# EAGLE design r2r-dac (EAGLE 7.6.0)
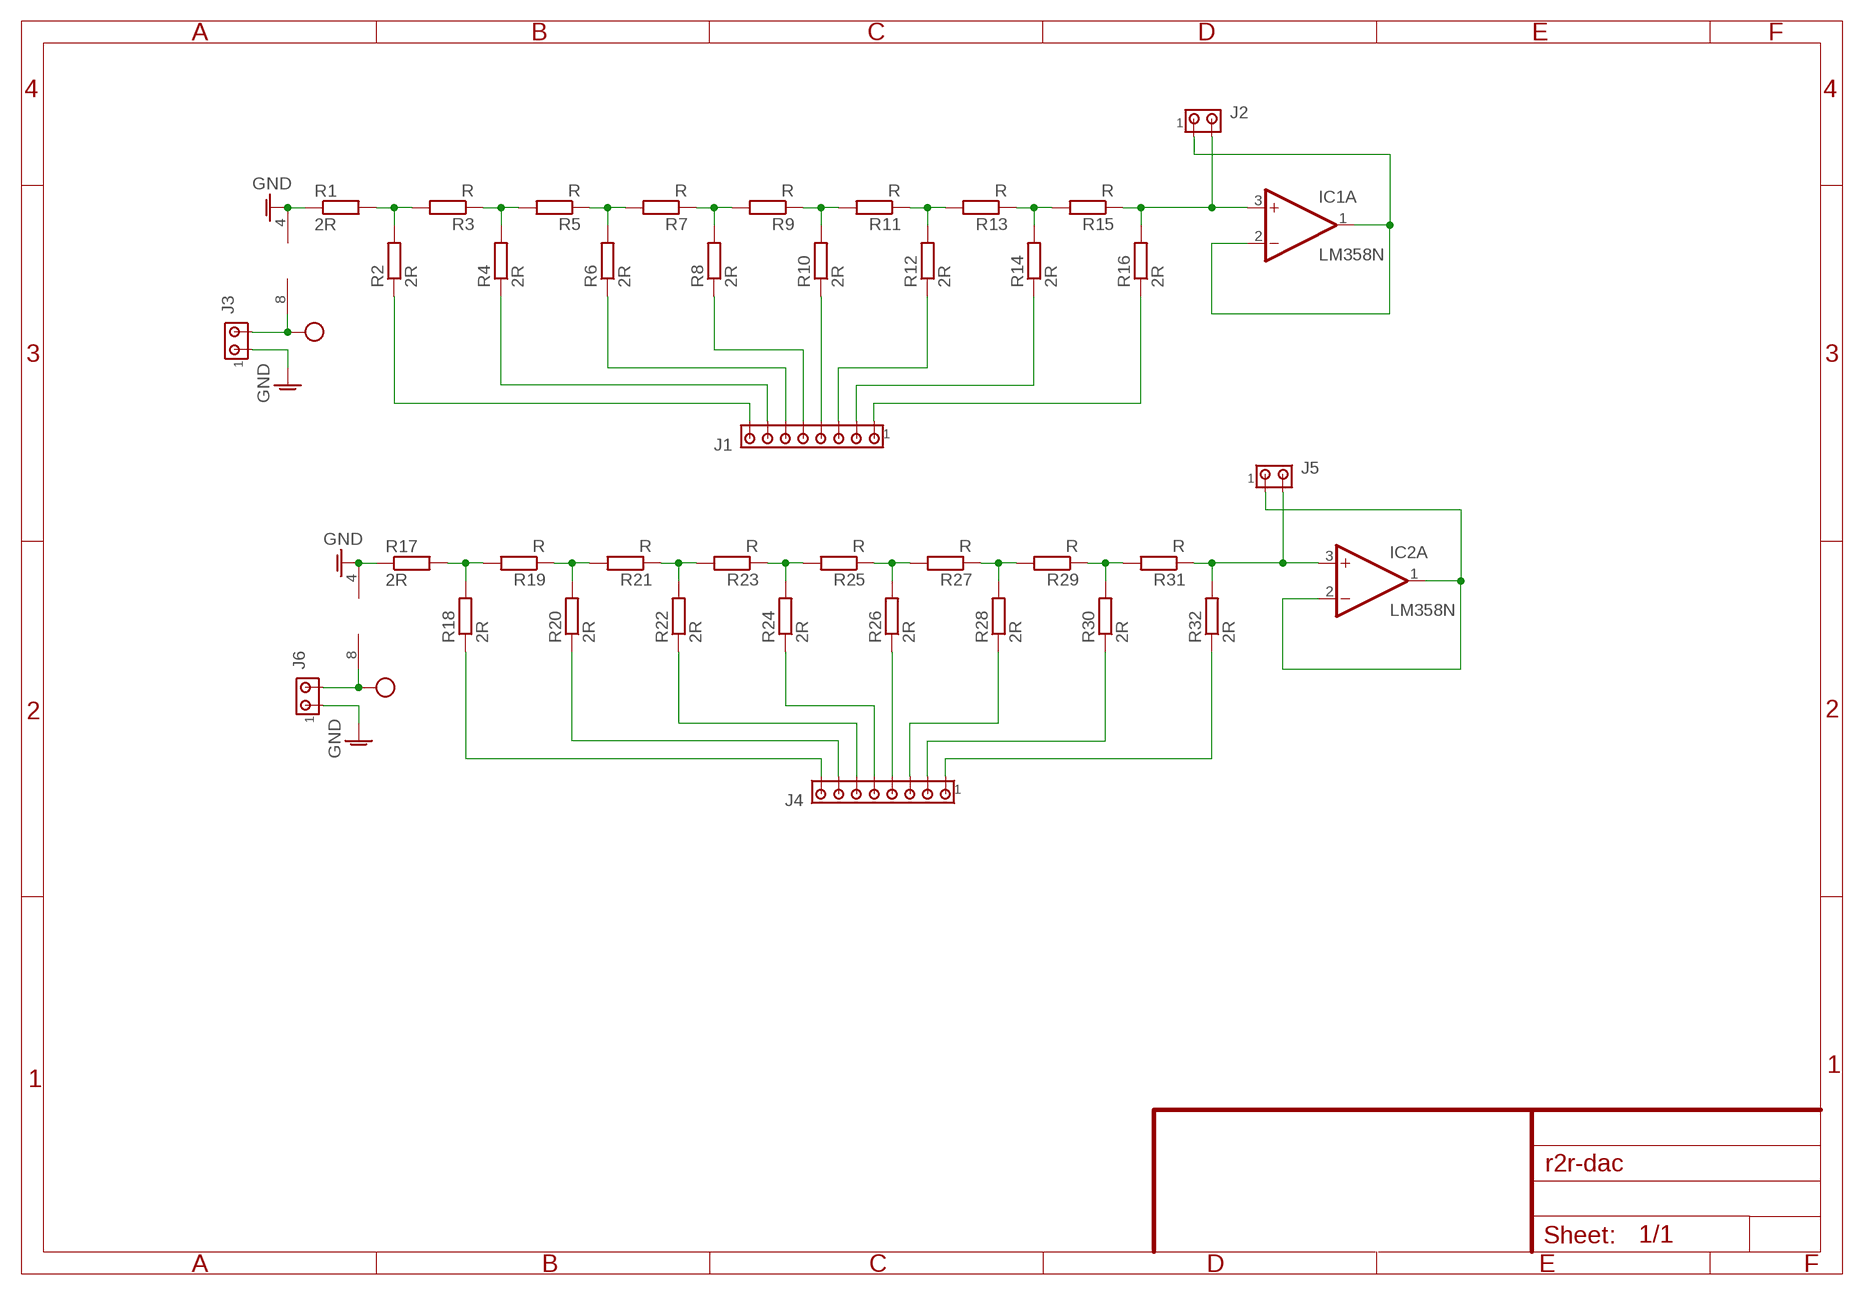
[diagram p0: schematic, sheet 1]

## Parts
IC1  LM358N  [DIL08]
IC2  LM358N  [DIL08]
J1  MTA08-100  [10X08MTA]
J2  MTA02-100  [10X02MTA]
J3  MTA02-100  [10X02MTA]
J4  MTA08-100  [10X08MTA]
J5  MTA02-100  [10X02MTA]
J6  MTA02-100  [10X02MTA]
R1  2R  R-EU_0207/10  [0207/10]
R2  2R  R-EU_0207/10  [0207/10]
R3  R  R-EU_0207/10  [0207/10]
R4  2R  R-EU_0207/10  [0207/10]
R5  R  R-EU_0207/10  [0207/10]
R6  2R  R-EU_0207/10  [0207/10]
R7  R  R-EU_0207/10  [0207/10]
R8  2R  R-EU_0207/10  [0207/10]
R9  R  R-EU_0207/10  [0207/10]
R10  2R  R-EU_0207/10  [0207/10]
R11  R  R-EU_0207/10  [0207/10]
R12  2R  R-EU_0207/10  [0207/10]
R13  R  R-EU_0207/10  [0207/10]
R14  2R  R-EU_0207/10  [0207/10]
R15  R  R-EU_0207/10  [0207/10]
R16  2R  R-EU_0207/10  [0207/10]
R17  2R  R-EU_0207/10  [0207/10]
R18  2R  R-EU_0207/10  [0207/10]
R19  R  R-EU_0207/10  [0207/10]
R20  2R  R-EU_0207/10  [0207/10]
R21  R  R-EU_0207/10  [0207/10]
R22  2R  R-EU_0207/10  [0207/10]
R23  R  R-EU_0207/10  [0207/10]
R24  2R  R-EU_0207/10  [0207/10]
R25  R  R-EU_0207/10  [0207/10]
R26  2R  R-EU_0207/10  [0207/10]
R27  R  R-EU_0207/10  [0207/10]
R28  2R  R-EU_0207/10  [0207/10]
R29  R  R-EU_0207/10  [0207/10]
R30  2R  R-EU_0207/10  [0207/10]
R31  R  R-EU_0207/10  [0207/10]
R32  2R  R-EU_0207/10  [0207/10]

## Nets
GND: IC1.4(P:V-) IC2.4(P:V-) J3.1 J6.1 R1.1 R17.1
N$1: R1.2 R2.2 R3.2
N$2: R3.1 R4.2 R5.2
N$3: R5.1 R6.2 R7.2
N$4: R7.1 R8.2 R9.2
N$5: R9.1 R10.2 R11.2
N$6: R11.1 R12.2 R13.2
N$7: R13.1 R14.2 R15.2
N$8: IC1.3(A:+IN) J2.2 R15.1 R16.2
N$9: J1.8 R2.1
N$10: J1.7 R4.1
N$11: J1.6 R6.1
N$12: J1.5 R8.1
N$13: J1.4 R10.1
N$14: J1.3 R12.1
N$15: J1.2 R14.1
N$16: J1.1 R16.1
N$17: R17.2 R18.2 R19.2
N$19: IC1.1(A:OUT) IC1.2(A:-IN) J2.1
N$20: R19.1 R20.2 R21.2
N$21: R21.1 R22.2 R23.2
N$22: R23.1 R24.2 R25.2
N$23: R25.1 R26.2 R27.2
N$24: R27.1 R28.2 R29.2
N$25: R29.1 R30.2 R31.2
N$26: IC2.3(A:+IN) J5.2 R31.1 R32.2
N$27: J4.8 R18.1
N$28: J4.7 R20.1
N$29: J4.6 R22.1
N$30: J4.5 R24.1
N$31: J4.4 R26.1
N$32: J4.3 R28.1
N$33: J4.2 R30.1
N$34: J4.1 R32.1
N$35: IC2.1(A:OUT) IC2.2(A:-IN) J5.1
VDD: IC1.8(P:V+) IC2.8(P:V+) J3.2 J6.2
Unconnected: IC1.5(B:+IN) IC1.6(B:-IN) IC1.7(B:OUT) IC2.5(B:+IN) IC2.6(B:-IN) IC2.7(B:OUT)

## Library data of the parts
IC1 IC2 = linear:LM358N: OP AMP
J1 J4 = con-amp:MTA08-100: AMP CONNECTOR
J2 J3 J5 J6 = con-amp:MTA02-100: AMP CONNECTOR
R1-R32 = rcl:R-EU_: RESISTOR, European symbol

## Board
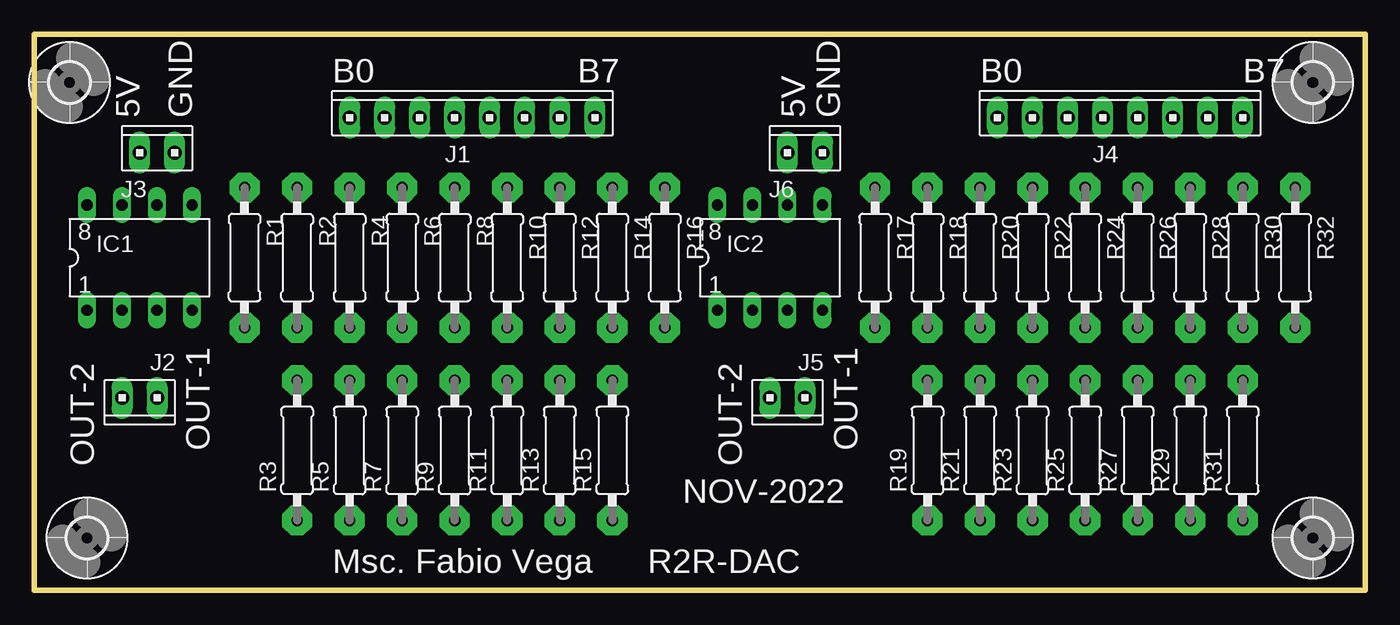
[diagram p1: board, top side]
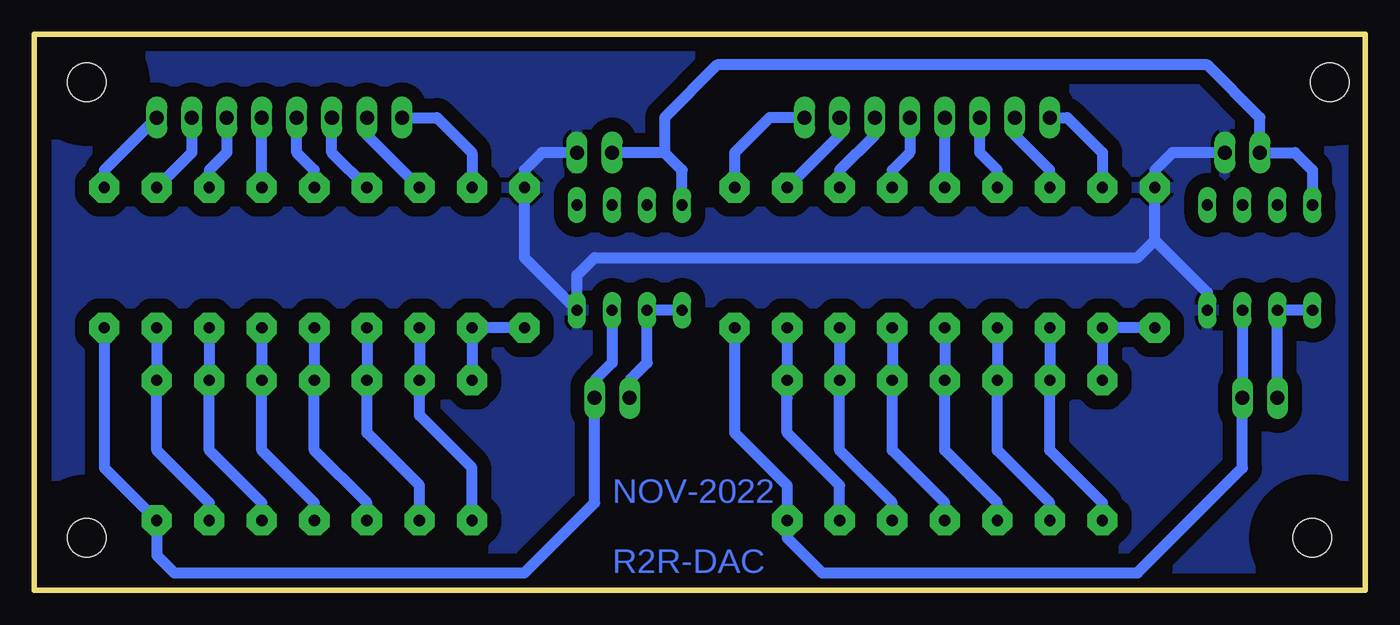
[diagram p2: board, bottom side, seen from below]

Size 96.5 x 40.31 mm. Coordinates in mm from the lower left corner, seen from the top.
Outline: 0,0 96.5,0 96.5,40.31 0,40.31 0,0
Copper layers (1*16): Top 0.035mm / dielectric 1.5mm / Bottom 0.035mm
Design rules "default": minimum track width 10mil, minimum drill 24mil, track to track 8mil, track to pad 8mil, pad to pad 8mil, via to via 8mil, smd to smd 8mil, copper to edge 40mil, drill to drill 8mil, minimum pad ring 10mil, minimum via ring 8mil, stop-mask expansion 4mil, vias tented up to drill 0mil, thermal gap 10mil

### Footprints (pad centres in the part's own frame; a part is rotated, then mirrored left to right if it is on the bottom)
DIL08 = drill 0.813 long: 1 -3.81,-3.81; 2 -1.27,-3.81; 3 1.27,-3.81; 4 3.81,-3.81; 5 3.81,3.81; 6 1.27,3.81; 7 -1.27,3.81; 8 -3.81,3.81
10X08MTA = drill 1.016 long: 1 8.89,0; 2 6.35,0; 3 3.81,0; 4 1.27,0; 5 -1.27,0; 6 -3.81,0; 7 -6.35,0; 8 -8.89,0
10X02MTA = drill 1.016 long: 1 1.27,0; 2 -1.27,0
0207/10 = drill 0.813 pad 2.184 octagon: 1 -5.08,0; 2 5.08,0
2,8 = hole 2.8: 0,0

### Placement (x,y rotation side)
IC1  7.62,24.13 0 top
IC2  53.34,24.13 0 top
J1  31.75,34.29 0 top
J2  7.62,13.97 180 top
J3  8.89,31.75 0 top
J4  78.74,34.29 0 top
J5  54.61,13.97 180 top
J6  55.88,31.75 0 top
R1  15.24,24.13 270 top
R2  19.05,24.13 270 top
R3  19.05,10.16 90 top
R4  22.86,24.13 270 top
R5  22.86,10.16 90 top
R6  26.67,24.13 270 top
R7  26.67,10.16 90 top
R8  30.48,24.13 270 top
R9  30.48,10.16 90 top
R10  34.29,24.13 270 top
R11  34.29,10.16 90 top
R12  38.1,24.13 270 top
R13  38.1,10.16 90 top
R14  41.91,24.13 270 top
R15  41.91,10.16 90 top
R16  45.72,24.13 270 top
R17  60.96,24.13 270 top
R18  64.77,24.13 270 top
R19  64.77,10.16 90 top
R20  68.58,24.13 270 top
R21  68.58,10.16 90 top
R22  72.39,24.13 270 top
R23  72.39,10.16 90 top
R24  76.2,24.13 270 top
R25  76.2,10.16 90 top
R26  80.01,24.13 270 top
R27  80.01,10.16 90 top
R28  83.82,24.13 270 top
R29  83.82,10.16 90 top
R30  87.63,24.13 270 top
R31  87.63,10.16 90 top
R32  91.44,24.13 270 top
U$1  [2,8]  92.71,36.83 0 top
U$2  [2,8]  92.71,3.81 0 top
U$3  [2,8]  3.81,3.81 0 top
U$4  [2,8]  2.54,36.83 0 top

### Tracks (layer width: path | path; a pad name or v marks a point on that pad's centre or on a via)
GND
  Bottom 0.813: IC1.4 11.43,21.59 15.24,25.4 | 15.24,25.4 R1.1 15.24,30.48 13.97,31.75 J3.1 | J6.1 59.69,31.75 60.96,30.48 R17.1 60.96,24.13 IC2.4 57.15,22.86 55.88,24.13 16.51,24.13 15.24,25.4
  pour Bottom (isolate 1.016): 1.27,39.37 95.25,39.37 95.25,1.27 1.27,1.27
N$1
  Bottom 0.813: R1.2 R2.2 R3.2
N$2
  Bottom 0.813: R4.2 R5.2 22.86,10.16 19.05,6.35 R3.1
N$3
  Bottom 0.813: R6.2 R7.2 26.67,10.16 22.86,6.35 R5.1
N$4
  Bottom 0.813: R8.2 R9.2 30.48,10.16 26.67,6.35 R7.1
N$5
  Bottom 0.813: R10.2 R11.2 34.29,10.16 30.48,6.35 R9.1
N$6
  Bottom 0.813: R12.2 R13.2 38.1,10.16 34.29,6.35 R11.1
N$7
  Bottom 0.813: R14.2 R15.2 | 41.91,13.97 R15.2 | R13.1 38.1,7.62 41.91,11.43 R15.2
N$8
  Bottom 0.813: IC1.3 J2.2 8.89,8.89 16.51,1.27 39.37,1.27 41.91,3.81 R15.1 41.91,7.62 45.72,11.43 R16.2
N$9
  Bottom 0.813: J1.8 21.59,34.29 19.05,31.75 R2.1
N$10
  Bottom 0.813: R4.1 22.86,30.48 25.4,33.02 J1.7
N$11
  Bottom 0.813: R6.1 26.67,30.48 27.94,31.75 J1.6
N$12
  Bottom 0.813: R8.1 J1.5
N$13
  Bottom 0.813: J1.4 33.02,31.75 34.29,30.48 R10.1
N$14
  Bottom 0.813: J1.3 35.56,33.02 38.1,30.48 R12.1
N$15
  Bottom 0.813: J1.2 38.1,33.02 R14.1
N$16
  Bottom 0.813: J1.1 43.18,34.29 45.72,31.75 R16.1
N$17
  Bottom 0.813: R17.2 R18.2 R19.2
N$19
  Bottom 0.813: J2.1 IC1.2 IC1.1
N$20
  Bottom 0.813: R20.2 R21.2 68.58,12.7 64.77,8.89 R19.1
N$21
  Bottom 0.813: R22.2 R23.2 72.39,11.43 68.58,7.62 R21.1
N$22
  Bottom 0.813: R24.2 R25.2 76.2,10.16 72.39,6.35 R23.1
N$23
  Bottom 0.813: R26.2 R27.2 80.01,10.16 76.2,6.35 R25.1
N$24
  Bottom 0.813: R28.2 R29.2 83.82,10.16 80.01,6.35 R27.1
N$25
  Bottom 0.813: R30.2 R31.2 87.63,10.16 83.82,6.35 R29.1
N$26
  Bottom 0.813: IC2.3 54.61,16.51 55.88,15.24 J5.2 55.88,6.35 60.96,1.27 86.36,1.27 87.63,2.54 R31.1 91.44,8.89 R32.2
N$27
  Bottom 0.813: J4.8 67.31,34.29 64.77,31.75 R18.1
N$28
  Bottom 0.813: R20.1 72.39,33.02 J4.7
N$29
  Bottom 0.813: R22.1 74.93,31.75 J4.6
N$30
  Bottom 0.813: R24.1 76.2,30.48 77.47,31.75 J4.5
N$31
  Bottom 0.813: R26.1 J4.4
N$32
  Bottom 0.813: J4.3 82.55,31.75 83.82,30.48 R28.1
N$33
  Bottom 0.813: J4.2 85.09,31.75 R30.1
N$34
  Bottom 0.813: J4.1 91.44,30.48 R32.1
N$35
  Bottom 0.813: IC2.1 IC2.2 52.07,16.51 53.34,15.24 J5.1
VDD
  Bottom 0.813: IC1.8 3.81,30.48 5.08,31.75 J3.2 7.62,34.29 11.43,38.1 46.99,38.1 50.8,34.29 50.8,31.75 | IC2.8 49.53,30.48 50.8,31.75 | 50.8,31.75 J6.2

### Text on the board
Bottom: NOV-2022 | R2R-DAC
tPlace: B0 | B7 | B0 | B7 | 5V | GND | 5V | GND | OUT-2 | OUT-2 | OUT-1 | OUT-1 | NOV-2022 | Msc. Fabio Vega | R2R-DAC